# Altium schematic sheet 4-POWER.SchDoc
size A3
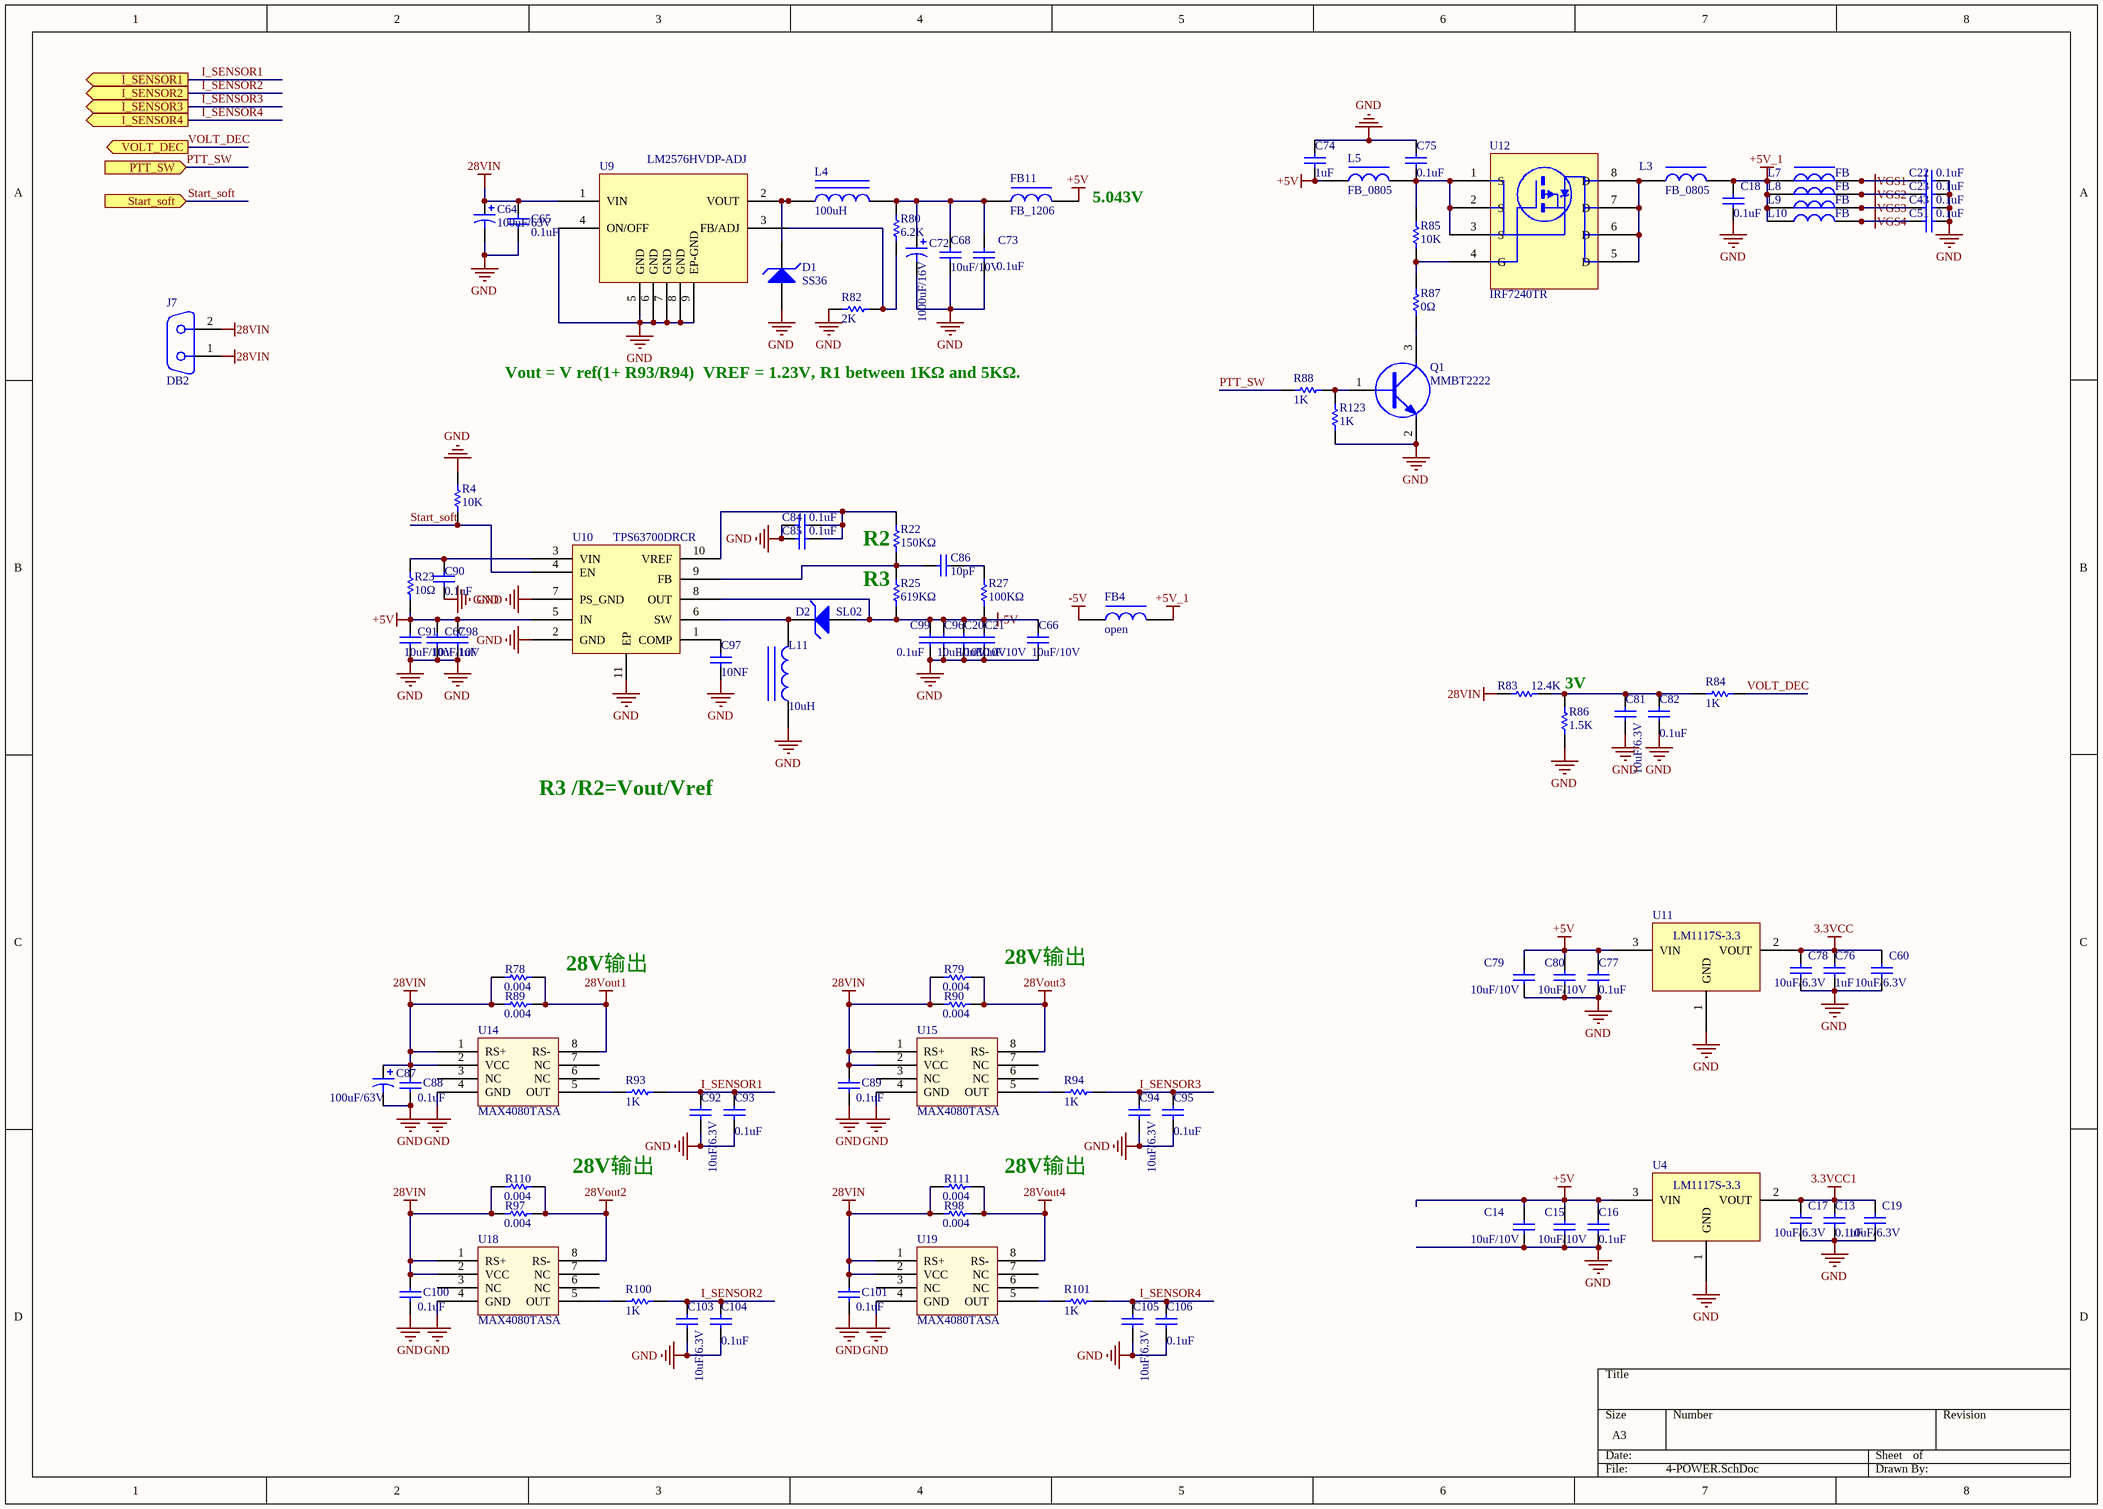
[diagram p0: 4-POWER.SchDoc]

## Parts
C13  0.1uF  [C0603]
C14  10uF/10V  [C0805]
C15  10uF/10V  [C0805]
C16  0.1uF  [C0603]
C17  10uF/6.3V  [C0603]
C18  0.1uF  [C0603]
C19  10uF/6.3V  [C0603]
C20  10uF/10V  [C0805]
C21  10uF/10V  [C0805]
C22  0.1uF  [C0603]
C23  0.1uF  [C0603]
C43  0.1uF  [C0603]
C51  0.1uF  [C0603]
C60  10uF/6.3V  [C0603]
C64  100uF/63V  [ECAP2SM_10R4x10R4]
C65  0.1uF  [C0603]
C66  10uF/10V  [C0805]
C67  10uF/10V  [C0805]
C68  10uF/10V  [C0805]
C72  1000uF/16V  [ECAP2SM_10R4x10R4]
C73  0.1uF  [C0603]
C74  1uF  [C0603]
C75  0.1uF  [C0603]
C76  1uF  [C0603]
C77  0.1uF  [C0603]
C78  10uF/6.3V  [C0603]
C79  10uF/10V  [C0805]
C80  10uF/10V  [C0805]
C81  10uF/6.3V  [C0603]
C82  0.1uF  [C0603]
C84  0.1uF  [C0603]
C85  0.1uF  [C0603]
C86  10pF  [C0603]
C87  100uF/63V  [ECAP2SM_10R4x10R4]
C88  0.1uF  [C0603]
C89  0.1uF  [C0603]
C90  0.1uF  [C0603]
C91  10uF/10V  [C0805]
C92  10uF/6.3V  [C0603]
C93  0.1uF  [C0603]
C94  10uF/6.3V  [C0603]
C95  0.1uF  [C0603]
C96  10uF/10V  [C0805]
C97  10NF  [C0603]
C98  1uF  [C0603]
C99  0.1uF  [C0603]
C100  0.1uF  [C0603]
C101  0.1uF  [C0603]
C103  10uF/6.3V  [C0603]
C104  0.1uF  [C0603]
C105  10uF/6.3V  [C0603]
C106  0.1uF  [C0603]
D1  SS36  [DO-214AC]
D2  SL02  [SL02]
FB4  open  [L0805]
FB11  FB_1206  [L1206]
J7  DB2  [DB2TM-VM]
L3  FB_0805  [L0805]
L4  100uH  [PL2SM-12R5x12R5]
L5  FB_0805  [L0805]
L7  FB  [L0805]
L8  FB  [L0805]
L9  FB  [L0805]
L10  FB  [L0805]
L11  10uH  [PL2SM-3R0x3R0]
Q1  MMBT2222  [SOT23-3]
R4  10K  [R0603]
R22  150KΩ  [R0603]
R23  10Ω  [R0603]
R25  619KΩ  [R0603]
R27  100KΩ  [R0603]
R78  0.004  [R2512]
R79  0.004  [R2512]
R80  6.2K  [R0603]
R82  2K  [R0603]
R83  12.4K  [R0603]
R84  1K  [C0603]
R85  10K  [R0603]
R86  1.5K  [R0603]
R87  0Ω  [R0603]
R88  1K  [R0603]
R89  0.004  [R2512]
R90  0.004  [R2512]
R93  1K  [R0603]
R94  1K  [R0603]
R97  0.004  [R2512]
R98  0.004  [R2512]
R100  1K  [R0603]
R101  1K  [R0603]
R110  0.004  [R2512]
R111  0.004  [R2512]
R123  1K  [R0603]
U4  LM1117S-3.3  [SOT-223]
U9  LM2576HVDP-ADJ  [SOIC8_1R27_3R9x4R9-1]
U10  TPS63700DRCR  [VSON10-0R5-3x3]
U11  LM1117S-3.3  [SOT-223]
U12  IRF7240TR  [SOIC8_1R27_3R9x4R9]
U14  MAX4080TASA  [SOIC8_1R27_3R9x4R9]
U15  MAX4080TASA  [SOIC8_1R27_3R9x4R9]
U18  MAX4080TASA  [SOIC8_1R27_3R9x4R9]
U19  MAX4080TASA  [SOIC8_1R27_3R9x4R9]

## Ports
I_SENSOR1 (out), I_SENSOR2 (out), I_SENSOR3 (out), I_SENSOR4 (out), PTT_SW (in), Start_soft (in), VOLT_DEC (out)

## Nets
3.3VCC: C60.2 C76.2 C78.2 U11.2(VOUT)
3.3VCC1: C13.2 C17.2 C19.2 U4.2(VOUT)
28VIN: C64.1 C65.2 C87.1 C88.2 C89.2 C100.2 C101.2 J7.1 J7.2 R78.1 R79.1 R83.1 R89.1 R90.1 R97.1 R98.1 R110.1 R111.1 U9.1(VIN) U14.1(RS+) U14.2(VCC) U15.1(RS+) U15.2(VCC) U18.1(RS+) U18.2(VCC) U19.1(RS+) U19.2(VCC)
28Vout1: R78.2 R89.2 U14.8(RS-)
28Vout2: R97.2 R110.2 U18.8(RS-)
28Vout3: R79.2 R90.2 U15.8(RS-)
28Vout4: R98.2 R111.2 U19.8(RS-)
+5V: C14.2 C15.2 C16.2 C67.2 C74.1 C77.2 C79.2 C80.2 C91.2 C98.2 FB11.2 L5.1 R23.1 U4.3(VIN) U10.5(IN) U11.3(VIN)
+5V_1: C18.2 FB4.2 L3.2 L7.1 L8.1 L9.1 L10.1
-5V: C20.2 C21.2 C66.2 C96.2 C99.2 D2.1(A) FB4.1 R25.1 R27.1 U10.8(OUT)
GND: C13.1 C14.1 C15.1 C16.1 C17.1 C18.1 C19.1 C20.1 C21.1 C22.2 C23.2 C43.2 C51.2 C60.1 C64.2 C65.1 C66.1 C67.1 C68.1 C72.2 C73.1 C74.2 C75.2 C76.1 C77.1 C78.1 C79.1 C80.1 C81.1 C82.1 C84.2 C85.2 C87.2 C88.1 C89.1 C90.1 C91.1 C92.1 C93.1 C94.1 C95.1 C96.1 C97.1 C98.1 C99.1 C100.1 C101.1 C103.1 C104.1 C105.1 C106.1 D1.1(A) L11.1 Q1.2(E) R4.2 R82.2 R86.1 R123.1 U4.1(GND) U9.4(ON/OFF) U9.5(GND) U9.6(GND) U9.7(GND) U9.8(GND) U9.9(EP-GND) U10.2(GND) U10.7(PS_GND) U10.11(EP) U11.1(GND) U14.4(GND) U15.4(GND) U18.4(GND) U19.4(GND)
VGS1: C22.1 L7.2
VGS2: C23.1 L8.2
VGS3: C43.1 L9.2
VGS4: C51.1 L10.2
I_SENSOR1: C92.2 C93.2 R93.2 ; port I_SENSOR1
I_SENSOR2: C103.2 C104.2 R100.2 ; port I_SENSOR2
I_SENSOR3: C94.2 C95.2 R94.2 ; port I_SENSOR3
I_SENSOR4: C105.2 C106.2 R101.2 ; port I_SENSOR4
PTT_SW: R88.1 ; port PTT_SW
Start_soft: R4.1 U10.4(EN) ; port Start_soft
VOLT_DEC: R84.1 ; port VOLT_DEC
NetC68_2: C68.2 C72.1 C73.2 FB11.1 L4.2 R80.2
NetC75_1: C75.1 L5.2 R85.2 U12.1(S) U12.2(S) U12.3(S)
NetC81_2: C81.2 C82.2 R83.2 R84.2 R86.2
NetC84_1: C84.1 C85.1 R22.2 U10.10(VREF)
NetC86_1: C86.1 R22.1 R25.2 U10.9(FB)
NetC86_2: C86.2 R27.2
NetC90_2: C90.2 R23.2 U10.3(VIN)
NetC97_2: C97.2 U10.1(COMP)
NetD1_2: D1.2(K) L4.1 U9.2(VOUT)
NetD2_2: D2.2(K) L11.2 U10.6(SW)
NetL3_1: L3.1 U12.5(D) U12.6(D) U12.7(D) U12.8(D)
NetQ1_1: Q1.1(B) R88.2 R123.2
NetQ1_3: Q1.3(C) R87.1
NetR80_1: R80.1 R82.1 U9.3(FB/ADJ)
NetR85_1: R85.1 R87.2 U12.4(G)
NetR93_1: R93.1 U14.5(OUT)
NetR94_1: R94.1 U15.5(OUT)
NetR100_1: R100.1 U18.5(OUT)
NetR101_1: R101.1 U19.5(OUT)

Not connected (* = marked no-connect by the designer): U14 3(NC) 6(NC) 7(NC); U15 3(NC) 6(NC) 7(NC); U18 3(NC) 6(NC) 7(NC); U19 3(NC) 6(NC) 7(NC)

## Notes on the sheet
- (near FB11) 5.043V
- Vout = V ref(1+ R93/R94)  VREF = 1.23V, R1 between 1KΩ and 5KΩ.
- R3
- (near R22) R2
- (near R86) 3V
- R3 /R2=Vout/Vref
- 28V输出

## Library data of the parts
C13 C74 C76 = 1uF贴片电容: 贴片电容_GRM188R61A105KA61D_1uF±10%,10V,0603; code: 01010038
C14 C15 C20 C21 C66-C68 C79 C80 C91 C96 = 10uF贴片电容: 贴片电容_GRM21BR61A106KE19L_10uF±10%,10V,0805; code: 01010036
C16 C65 C73 C75 C77 C82 C88 C89 C93 C95 C100 C101 C104 C106 = 0.1uF贴片电容: 贴片电容_GRM188R71H104KA01D_0.1uF±10%,50V,0603; code: 01010045
C17 C19 C60 C78 C81 C92 C94 C103 C105 = 10uF贴片电容: 贴片电容_GRM188R60J106ME47D_10uF±20%,6.3V,0603; code: 01010037
C18 C22 C23 C43 C51 C84 C85 C90 C99 = 0.1uF: GRM188R71H104KA01D; MPN: MURATA; WSPN: 01010045
C64 C87 = 100uF/63V: 贴片电解电容_VEJ101M1JTR-1010_100uF/63V,±20%,表贴D10*H10; code: 01080002
C72 = 1000uF/16V: 贴片电解电容_VE102M1CTR-1010_1000uF/16V,±20%,表贴10*10; code: 01080003
C86 = 10pF贴片电容: 贴片电容_0603CG100J500NT_10pF±5%,50V,0603; code: 01010001
C97 = 0.1uF: 0603,10NF,50V,±10％,X7R
C98 = 0.1uF
D1 = 肖特基整流二极管_SS36: 肖特基整流二极管_SS36_封装SMA,3A/60V; code: 01040003
D2 = 肖特基整流二极管_SS36: 肖特基整流二极管_SL02_1.1A/20V
FB4 L3 L5 L7-L10 = 0805贴片磁珠: 贴片磁珠_600R,0805; code: 01030023
FB11 = 1206贴片磁珠: 贴片磁珠_30R,6A,1206; code: 0103015
J7 = DB2公头座子: 连接器_DB2公头,电源接头; code: 0207001
L4 = 100uH贴片功率电感: 贴片功率电感_SLF12575T-101M1R9-PF_100uH±20%,额定电流1.9A,12.5x12.5; code: 01030003
L11 = SLF6025T-100M1R0-PF: SLF6025-10uH
Q1 = MMBT2222: NPN三极管_MMBT2222_表贴SOT23; code: 01050001
R4 R85 = 10K贴片电阻: 贴片电阻_10K±5%,0603; code: 01020011
R22 R25 R27 = 10Ω贴片电阻
R23 = 10Ω贴片电阻: 贴片电阻_10Ω±5%,0603; code: 01020104
R78 R79 R89 R90 R97 R98 R110 R111 = 0.004Ω检流电阻-大封装: 贴片电阻_LR12DTDSR004_0.004±5%,2W,2512; code: 01020105
R80 = 6.2K贴片电阻: 贴片电阻_6.2K±5%,0603; code: 01020106
R82 = 2K贴片电阻: 贴片电阻_2K±5%,0603; code: 01020086
R83 = 12.4K贴片电阻: 贴片电阻_12.4K±1%,0603; code: 01020125
R84 R88 R93 R94 R100 R101 R123 = 1K贴片电阻: 贴片电阻_1K±5%,0603; code: 01020082
R86 = 1.5K贴片电阻: 贴片电阻_1.5K±5%,0603; code: 01020063
R87 = 0Ω贴片电阻: 贴片电阻_0Ω±5%,0603; code: 01020010
U4 U11 = LM1117S-3.3: LDO_LM1117S-3.3_1A输出,SOT223; code: 01060031
U9 = LM2576HVDP-ADJ: 稳压集成电路_LM2576HVDP-ADJ_3A输出,SOIC8; code: 03020005; Maker: HTC
U10 = TPS63700DRCR: 负压转换器_TPS63700DRCR_360mA输出,VSON-10; Maker: TI
U12 = IRF7240TR: P-MOSFET_IRF7240TR_SOIC8; Maker: IR; code: 01050003
U14 U15 U18 U19 = MAX4080TASA: 电流检测放大器_MAX4080TASA_SOIC8; Maker: MAXIM; code: 01060003